# EasyEDA schematic EasyEDA_Schema_SourceFile.json
TITLE: Sheet_1; REV: 1.0; Date: 2022-10-30; Sheet: 1/1; Drawn By: neuvidor; Company: Your Company
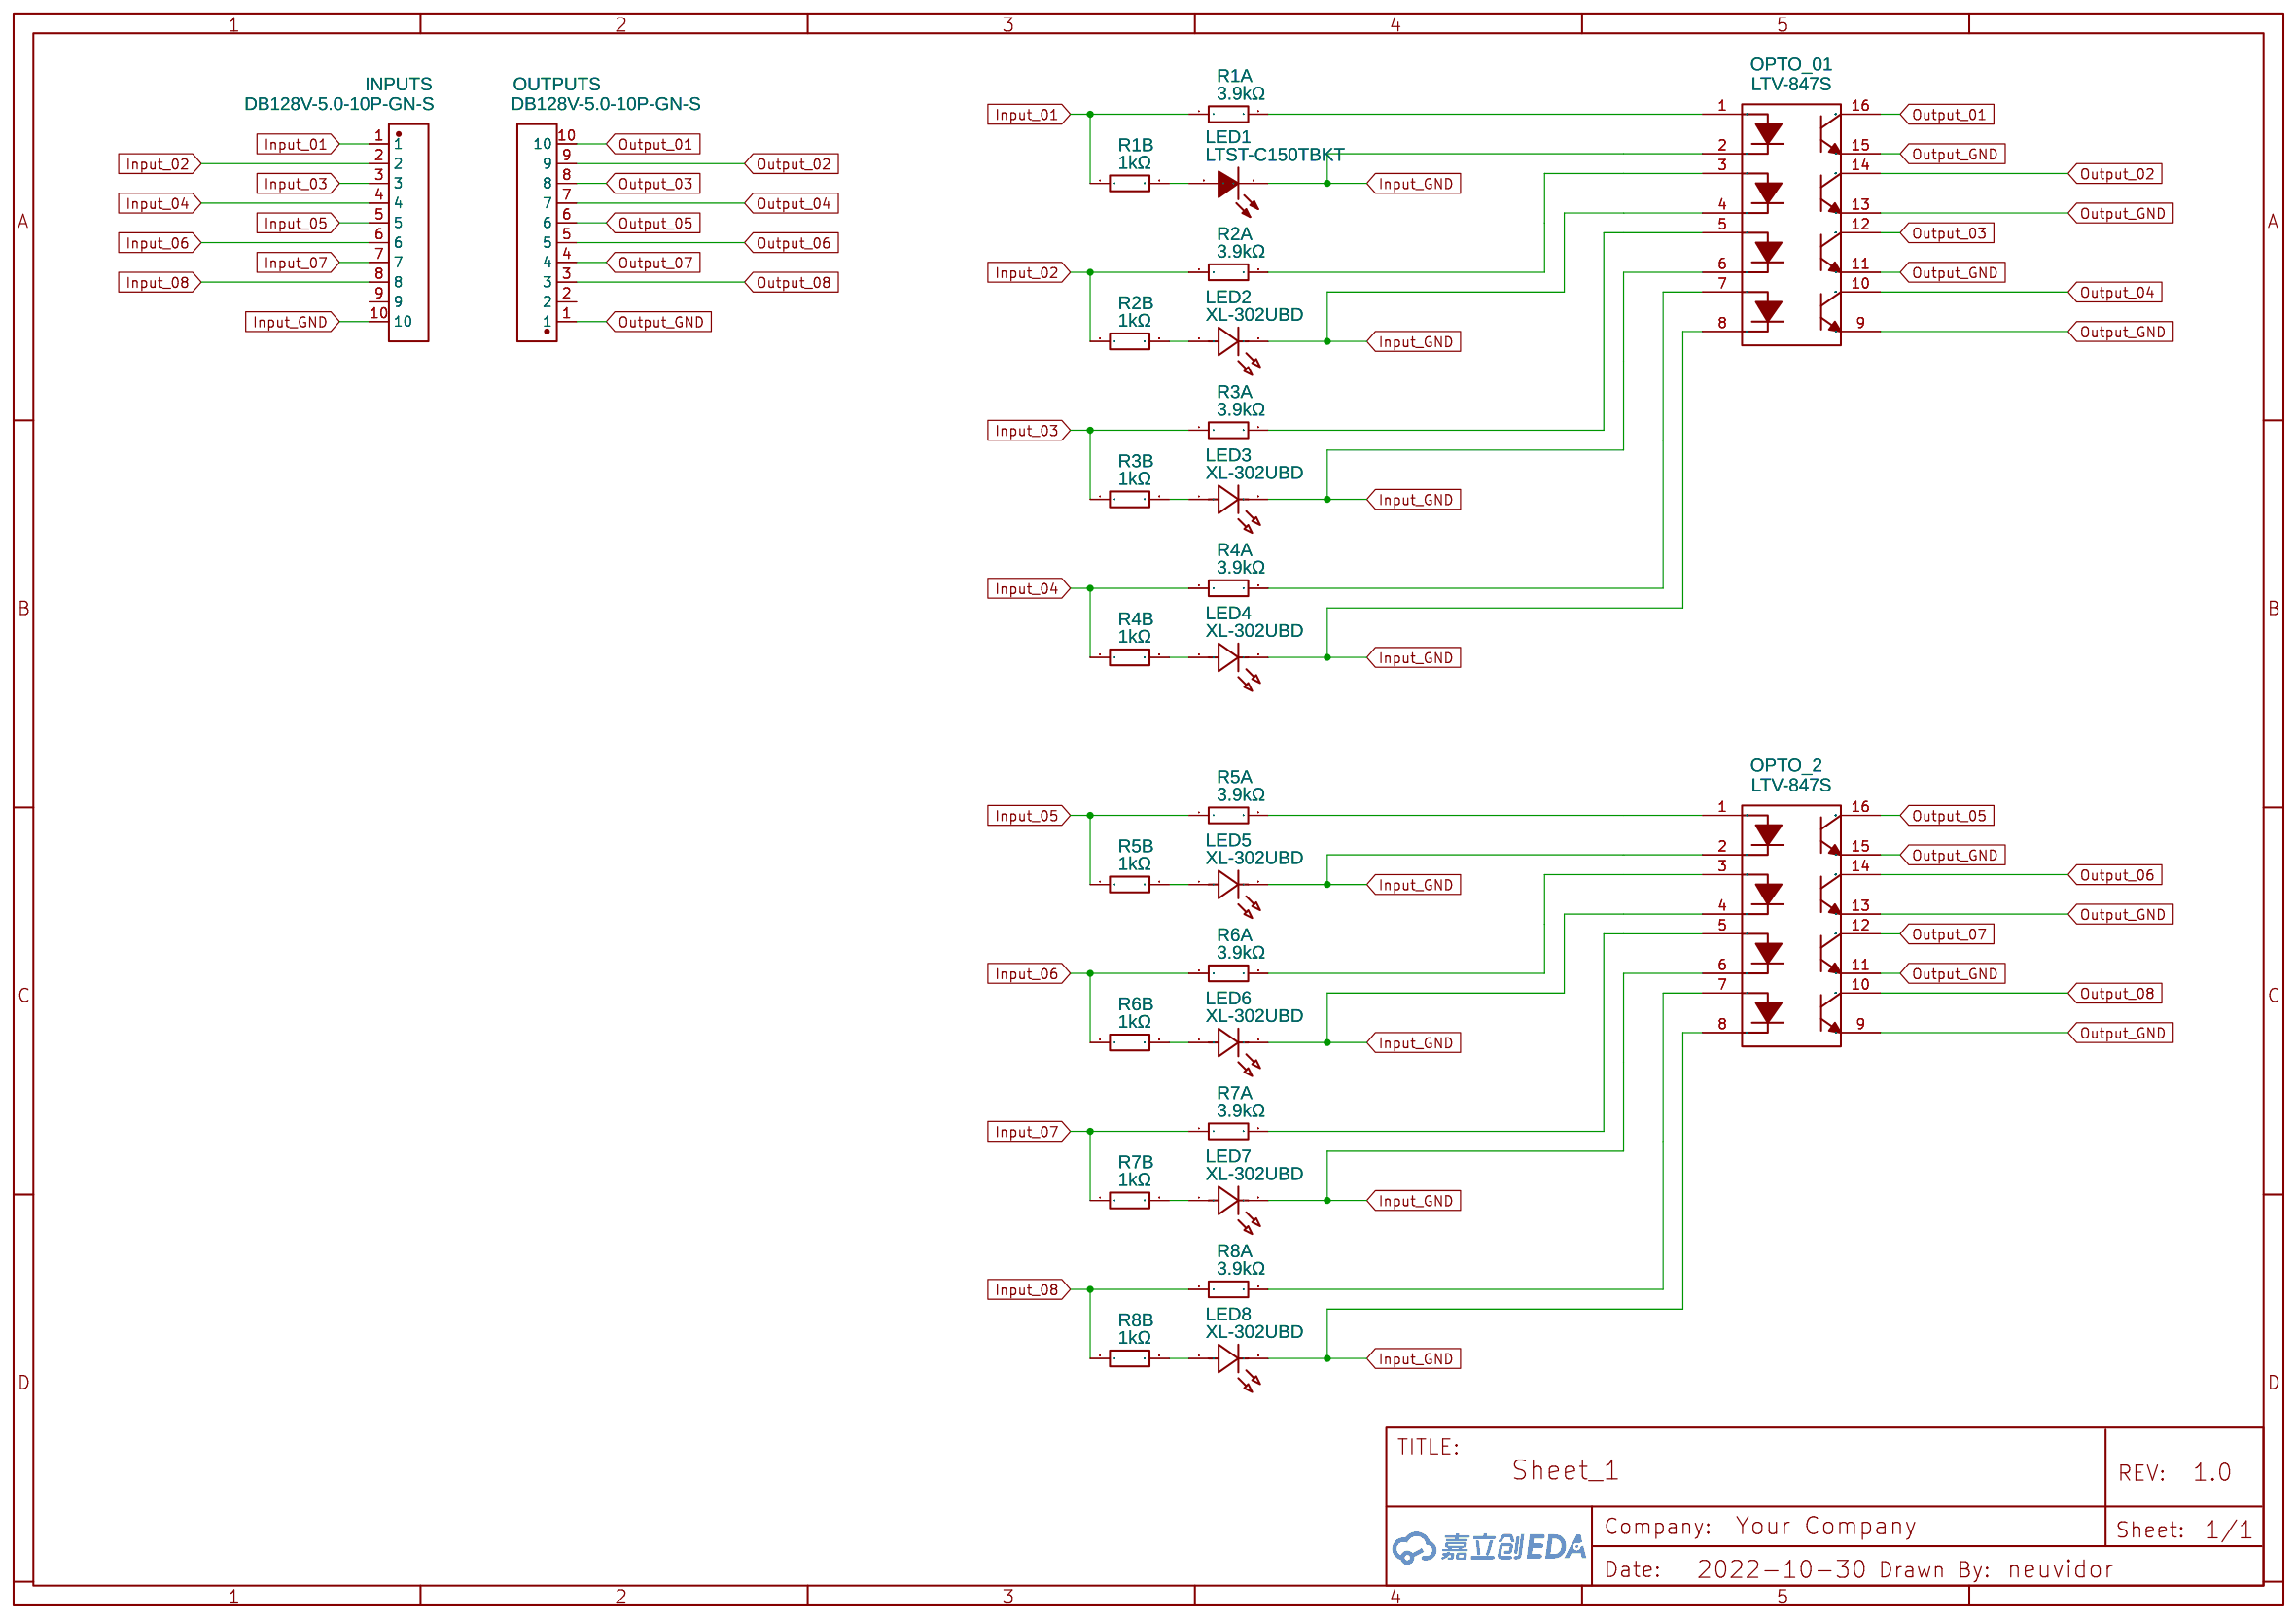
[diagram p0: schematic sheet]

## Parts
INPUTS  DB128V-5.0-10P-GN-S  [CONN-TH_DB128V-5.0-10P-GN-S]
LED1  LTST-C150TBKT  [LED1206-RD_BLUE]
LED2  XL-302UBD  [LED-TH_BD3.8-P2.54-FD_BLUE]
LED3  XL-302UBD  [LED-TH_BD3.8-P2.54-FD_BLUE]
LED4  XL-302UBD  [LED-TH_BD3.8-P2.54-FD_BLUE]
LED5  XL-302UBD  [LED-TH_BD3.8-P2.54-FD_BLUE]
LED6  XL-302UBD  [LED-TH_BD3.8-P2.54-FD_BLUE]
LED7  XL-302UBD  [LED-TH_BD3.8-P2.54-FD_BLUE]
LED8  XL-302UBD  [LED-TH_BD3.8-P2.54-FD_BLUE]
OPTO_01  LTV-847S  [SMD-16_L20.0-W6.5-P2.54-LS10.2-BL]
OPTO_2  LTV-847S  [SMD-16_L20.0-W6.5-P2.54-LS10.2-BL]
OUTPUTS  DB128V-5.0-10P-GN-S  [CONN-TH_DB128V-5.0-10P-GN-S]
R1A  3.9kΩ  [R1206]
R1B  1kΩ  [R1206]
R2A  3.9kΩ  [R1206]
R2B  1kΩ  [R1206]
R3A  3.9kΩ  [R1206]
R3B  1kΩ  [R1206]
R4A  3.9kΩ  [R1206]
R4B  1kΩ  [R1206]
R5A  3.9kΩ  [R1206]
R5B  1kΩ  [R1206]
R6A  3.9kΩ  [R1206]
R6B  1kΩ  [R1206]
R7A  3.9kΩ  [R1206]
R7B  1kΩ  [R1206]
R8A  3.9kΩ  [R1206]
R8B  1kΩ  [R1206]

## Library data of the parts
INPUTS OUTPUTS = DB128V-5.0-10P-GN-S: Supplier: LCSC; Supplier Part: C725714; Manufacturer: DIBO; Contributor: LCSC; JLCPCB Part Class: Extended Part
LED1 = LTST-C150TBKT: Supplier: LCSC; Manufacturer: LITEON; Contributor: LCSC; Supplier Part: C125088; JLCPCB Part Class: Extended Part
LED2-LED8 = XL-302UBD: Supplier: LCSC; Supplier Part: C2895474; Manufacturer: XINGLIGHT(成兴光); JLCPCB Part Class: Extended Part; Contributor: LCSC
OPTO_01 OPTO_2 = LTV-847S: Supplier: LCSC; Manufacturer: LITEON(台湾光宝); Contributor: LCSC; Supplier Part: C114599; JLCPCB Part Class: Extended Part
R1A R2A R3A R4A R5A R6A R7A R8A = AECR1206F3K90K9: Supplier: LCSC; Supplier Part: C352079; Manufacturer: ResistorToday; Resistance (Ohms): 3.9K; Contributor: LCSC; JLCPCB Part Class: Extended Part
R1B R2B R3B R4B R5B R6B R7B R8B = PTFR1206B1K00P9: Supplier: LCSC; Supplier Part: C351483; Manufacturer: ResistorToday; Contributor: LCSC; Resistance (Ohms): 1K; JLCPCB Part Class: Extended Part

## Nets
Input_01: INPUTS.1 R1A.1 R1B.1
Input_02: INPUTS.2 R2A.1 R2B.1
Input_03: INPUTS.3 R3A.1 R3B.1
Input_04: INPUTS.4 R4A.1 R4B.1
Input_05: INPUTS.5 R5A.1 R5B.1
Input_06: INPUTS.6 R6A.1 R6B.1
Input_07: INPUTS.7 R7A.1 R7B.1
Input_08: INPUTS.8 R8A.1 R8B.1
Input_GND: INPUTS.10 LED1.1(K) LED2.2(A) LED3.2(A) LED4.2(A) LED5.2(A) LED6.2(A) LED7.2(A) LED8.2(A) OPTO_01.2(CAT1) OPTO_01.4(CAT2) OPTO_01.6(CAT3) OPTO_01.8(CAT4) OPTO_2.2(CAT1) OPTO_2.4(CAT2) OPTO_2.6(CAT3) OPTO_2.8(CAT4)
Output_01: OPTO_01.16(COL1) OUTPUTS.10
Output_02: OPTO_01.14(COL2) OUTPUTS.9
Output_03: OPTO_01.12(COL3) OUTPUTS.8
Output_04: OPTO_01.10(COL4) OUTPUTS.7
Output_05: OPTO_2.16(COL1) OUTPUTS.6
Output_06: OPTO_2.14(COL2) OUTPUTS.5
Output_07: OPTO_2.12(COL3) OUTPUTS.4
Output_08: OPTO_2.10(COL4) OUTPUTS.3
Output_GND: OPTO_01.9(EM4) OPTO_01.11(EM3) OPTO_01.13(EM2) OPTO_01.15(EM1) OPTO_2.9(EM4) OPTO_2.11(EM3) OPTO_2.13(EM2) OPTO_2.15(EM1) OUTPUTS.1
Net-(LED1-2): LED1.2(A) R1B.2
Net-(LED2-1): LED2.1(K) R2B.2
Net-(LED3-1): LED3.1(K) R3B.2
Net-(LED4-1): LED4.1(K) R4B.2
Net-(LED5-1): LED5.1(K) R5B.2
Net-(LED6-1): LED6.1(K) R6B.2
Net-(LED7-1): LED7.1(K) R7B.2
Net-(LED8-1): LED8.1(K) R8B.2
Net-(OPTO_01-1): OPTO_01.1(AN1) R1A.2
Net-(OPTO_01-3): OPTO_01.3(AN2) R2A.2
Net-(OPTO_01-5): OPTO_01.5(AN3) R3A.2
Net-(OPTO_01-7): OPTO_01.7(AN4) R4A.2
Net-(OPTO_2-1): OPTO_2.1(AN1) R5A.2
Net-(OPTO_2-3): OPTO_2.3(AN2) R6A.2
Net-(OPTO_2-5): OPTO_2.5(AN3) R7A.2
Net-(OPTO_2-7): OPTO_2.7(AN4) R8A.2

Not connected (* = marked no-connect by the designer): INPUTS 9; OUTPUTS 2
